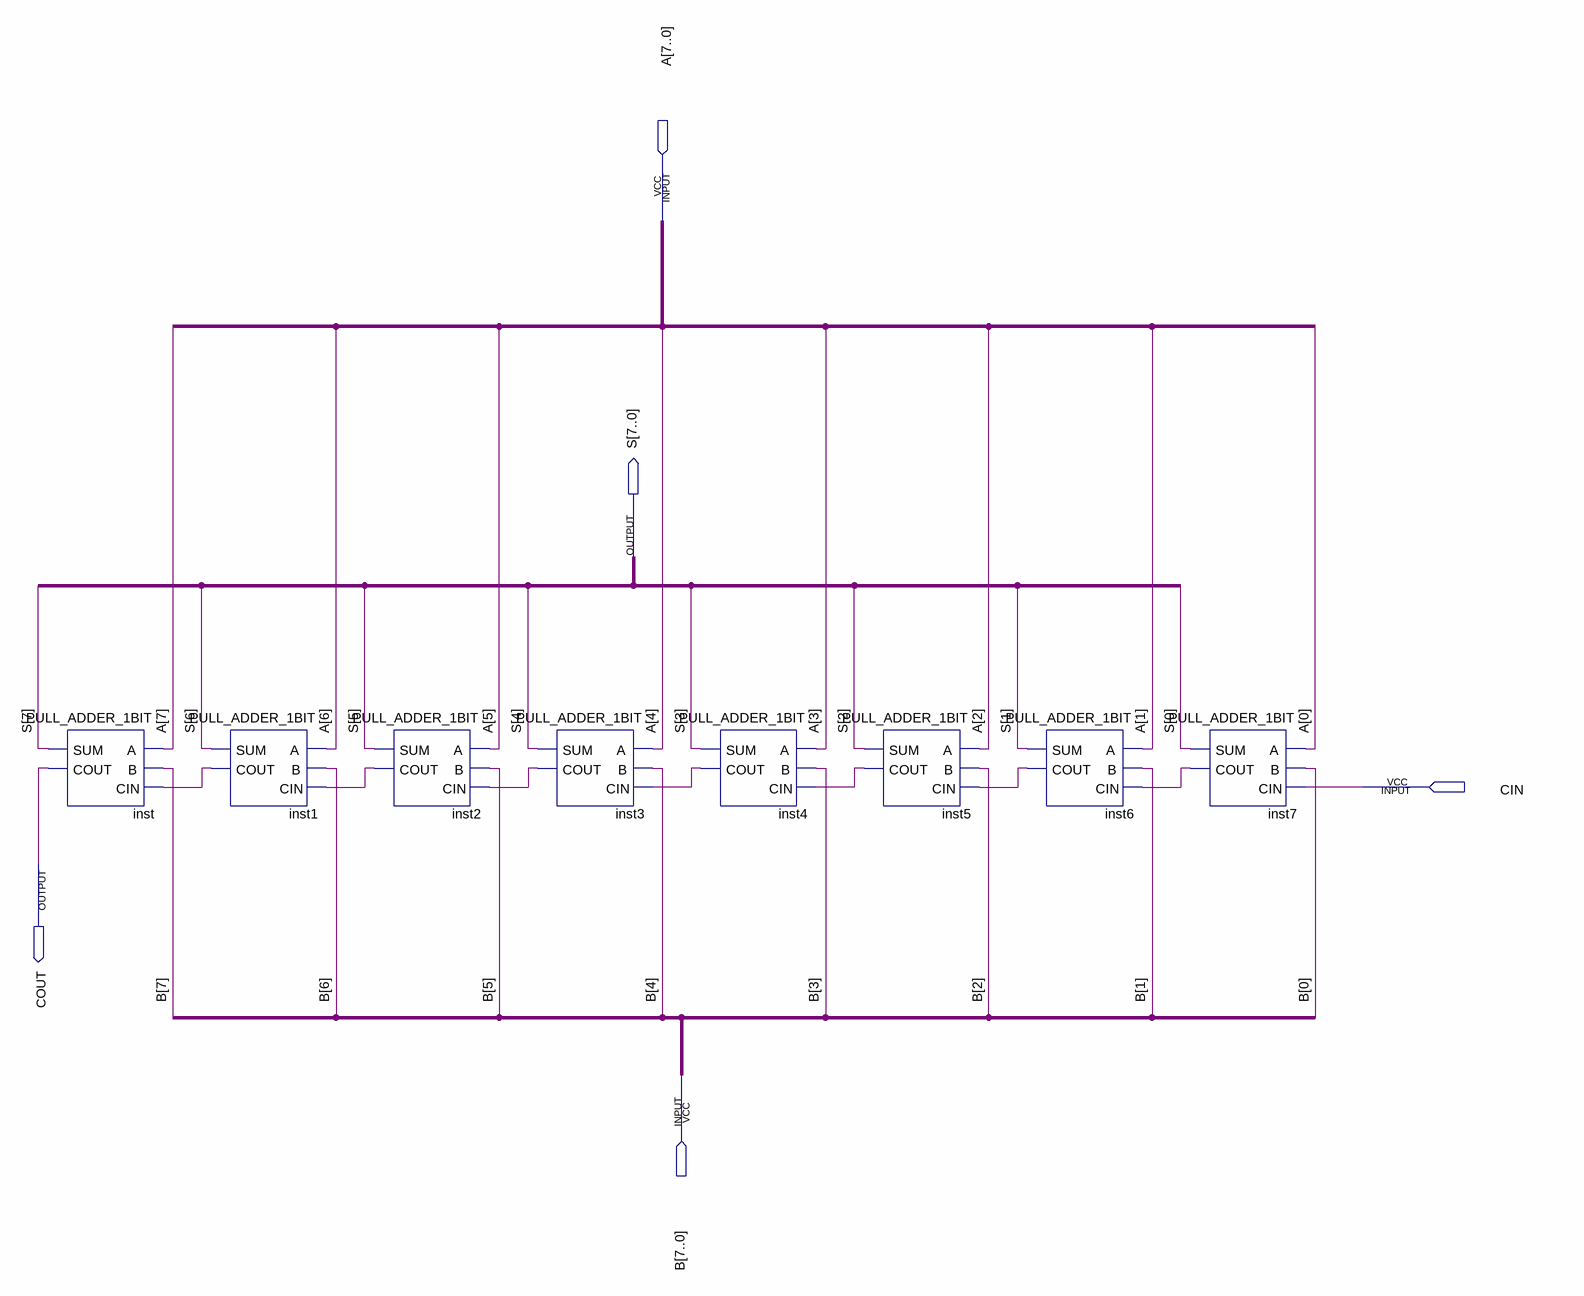
[diagram p0: schematic sheet]
// Quartus schematic FULL_ADDER_8BIT.bdf as structural Verilog: 8 symbols, 5 pins
module FULL_ADDER_8BIT (
  input  [7:0] A,
  input  CIN,
  input  [7:0] B,
  output [7:0] S,
  output COUT
);

  wire inst1_cout, inst2_cout, inst3_cout, inst4_cout, inst5_cout, inst6_cout, inst7_cout;

  PULL_ADDER_1BIT inst (.A(A[7]), .B(B[7]), .CIN(inst1_cout), .SUM(S[7]), .COUT(COUT));
  PULL_ADDER_1BIT inst1 (.A(A[6]), .B(B[6]), .CIN(inst2_cout), .SUM(S[6]), .COUT(inst1_cout));
  PULL_ADDER_1BIT inst2 (.A(A[5]), .B(B[5]), .CIN(inst3_cout), .SUM(S[5]), .COUT(inst2_cout));
  PULL_ADDER_1BIT inst3 (.A(A[4]), .B(B[4]), .CIN(inst4_cout), .SUM(S[4]), .COUT(inst3_cout));
  PULL_ADDER_1BIT inst4 (.A(A[3]), .B(B[3]), .CIN(inst5_cout), .SUM(S[3]), .COUT(inst4_cout));
  PULL_ADDER_1BIT inst5 (.A(A[2]), .B(B[2]), .CIN(inst6_cout), .SUM(S[2]), .COUT(inst5_cout));
  PULL_ADDER_1BIT inst6 (.A(A[1]), .B(B[1]), .CIN(inst7_cout), .SUM(S[1]), .COUT(inst6_cout));
  PULL_ADDER_1BIT inst7 (.A(A[0]), .B(B[0]), .CIN(CIN), .SUM(S[0]), .COUT(inst7_cout));
endmodule
